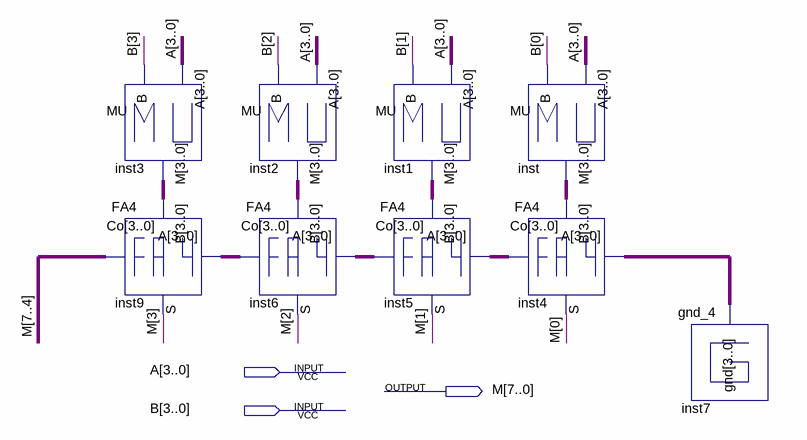
[diagram p0: schematic sheet]
// Quartus schematic MU4.bdf as structural Verilog: 9 symbols, 3 pins
module MU4 (
  input  [3:0] A,
  input  [3:0] B,
  output [7:0] M
);

  wire [3:0] inst1_m, inst2_m, inst3_m, inst4_co, inst5_co, inst6_co, inst7_gnd, inst_m;

  MU inst3 (.A(A), .B(B[3]), .M(inst3_m));
  FA4 inst9 (.A(inst6_co), .B(inst3_m), .Co(M[7:4]), .S(M[3]));
  MU inst2 (.A(A), .B(B[2]), .M(inst2_m));
  FA4 inst6 (.A(inst5_co), .B(inst2_m), .Co(inst6_co), .S(M[2]));
  MU inst1 (.A(A), .B(B[1]), .M(inst1_m));
  FA4 inst5 (.A(inst4_co), .B(inst1_m), .Co(inst5_co), .S(M[1]));
  MU inst (.A(A), .B(B[0]), .M(inst_m));
  FA4 inst4 (.A(inst7_gnd), .B(inst_m), .Co(inst4_co), .S(M[0]));
  gnd_4 inst7 (.gnd(inst7_gnd));
endmodule
